# EAGLE design solderingtest (EAGLE 9.5.1)
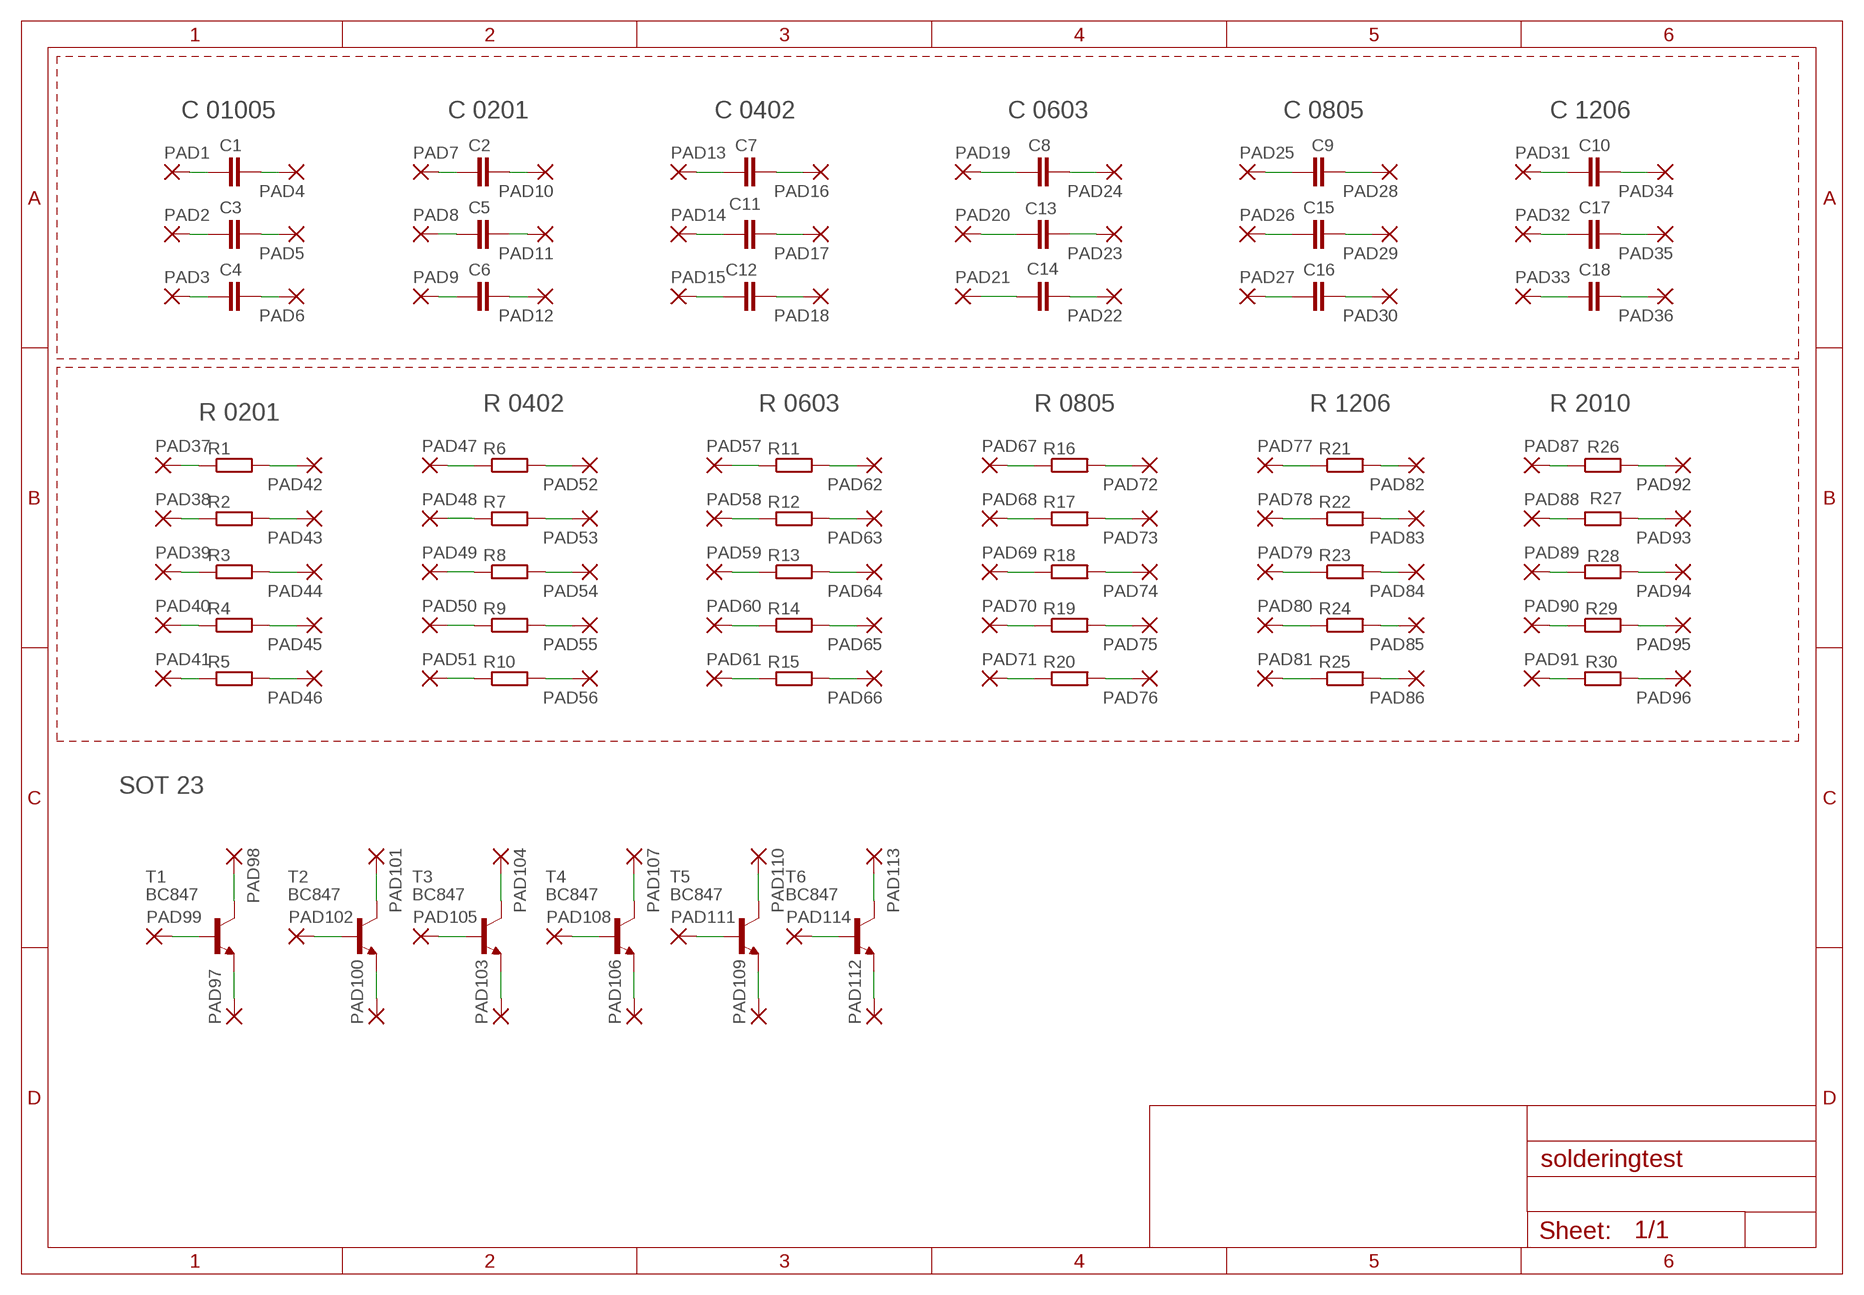
[diagram p0: schematic, sheet 1]

## Parts
C1  C-EU01005  [C01005]
C2  C-EUC0201  [C0201]
C3  C-EU01005  [C01005]
C4  C-EU01005  [C01005]
C5  C-EUC0201  [C0201]
C6  C-EUC0201  [C0201]
C7  C-EUC0402  [C0402]
C8  C-EUC0603  [C0603]
C9  C-EUC0805  [C0805]
C10  C-EUC1206  [C1206]
C11  C-EUC0402  [C0402]
C12  C-EUC0402  [C0402]
C13  C-EUC0603  [C0603]
C14  C-EUC0603  [C0603]
C15  C-EUC0805  [C0805]
C16  C-EUC0805  [C0805]
C17  C-EUC1206  [C1206]
C18  C-EUC1206  [C1206]
PAD1  2,54/1,0  [2,54/1,0]
PAD2  2,54/1,0  [2,54/1,0]
PAD3  2,54/1,0  [2,54/1,0]
PAD4  2,54/1,0  [2,54/1,0]
PAD5  2,54/1,0  [2,54/1,0]
PAD6  2,54/1,0  [2,54/1,0]
PAD7  2,54/1,0  [2,54/1,0]
PAD8  2,54/1,0  [2,54/1,0]
PAD9  2,54/1,0  [2,54/1,0]
PAD10  2,54/1,0  [2,54/1,0]
PAD11  2,54/1,0  [2,54/1,0]
PAD12  2,54/1,0  [2,54/1,0]
PAD13  2,54/1,0  [2,54/1,0]
PAD14  2,54/1,0  [2,54/1,0]
PAD15  2,54/1,0  [2,54/1,0]
PAD16  2,54/1,0  [2,54/1,0]
PAD17  2,54/1,0  [2,54/1,0]
PAD18  2,54/1,0  [2,54/1,0]
PAD19  2,54/1,0  [2,54/1,0]
PAD20  2,54/1,0  [2,54/1,0]
PAD21  2,54/1,0  [2,54/1,0]
PAD22  2,54/1,0  [2,54/1,0]
PAD23  2,54/1,0  [2,54/1,0]
PAD24  2,54/1,0  [2,54/1,0]
PAD25  2,54/1,0  [2,54/1,0]
PAD26  2,54/1,0  [2,54/1,0]
PAD27  2,54/1,0  [2,54/1,0]
PAD28  2,54/1,0  [2,54/1,0]
PAD29  2,54/1,0  [2,54/1,0]
PAD30  2,54/1,0  [2,54/1,0]
PAD31  2,54/1,0  [2,54/1,0]
PAD32  2,54/1,0  [2,54/1,0]
PAD33  2,54/1,0  [2,54/1,0]
PAD34  2,54/1,0  [2,54/1,0]
PAD35  2,54/1,0  [2,54/1,0]
PAD36  2,54/1,0  [2,54/1,0]
PAD37  2,54/1,0  [2,54/1,0]
PAD38  2,54/1,0  [2,54/1,0]
PAD39  2,54/1,0  [2,54/1,0]
PAD40  2,54/1,0  [2,54/1,0]
PAD41  2,54/1,0  [2,54/1,0]
PAD42  2,54/1,0  [2,54/1,0]
PAD43  2,54/1,0  [2,54/1,0]
PAD44  2,54/1,0  [2,54/1,0]
PAD45  2,54/1,0  [2,54/1,0]
PAD46  2,54/1,0  [2,54/1,0]
PAD47  2,54/1,0  [2,54/1,0]
PAD48  2,54/1,0  [2,54/1,0]
PAD49  2,54/1,0  [2,54/1,0]
PAD50  2,54/1,0  [2,54/1,0]
PAD51  2,54/1,0  [2,54/1,0]
PAD52  2,54/1,0  [2,54/1,0]
PAD53  2,54/1,0  [2,54/1,0]
PAD54  2,54/1,0  [2,54/1,0]
PAD55  2,54/1,0  [2,54/1,0]
PAD56  2,54/1,0  [2,54/1,0]
PAD57  2,54/1,0  [2,54/1,0]
PAD58  2,54/1,0  [2,54/1,0]
PAD59  2,54/1,0  [2,54/1,0]
PAD60  2,54/1,0  [2,54/1,0]
PAD61  2,54/1,0  [2,54/1,0]
PAD62  2,54/1,0  [2,54/1,0]
PAD63  2,54/1,0  [2,54/1,0]
PAD64  2,54/1,0  [2,54/1,0]
PAD65  2,54/1,0  [2,54/1,0]
PAD66  2,54/1,0  [2,54/1,0]
PAD67  2,54/1,0  [2,54/1,0]
PAD68  2,54/1,0  [2,54/1,0]
PAD69  2,54/1,0  [2,54/1,0]
PAD70  2,54/1,0  [2,54/1,0]
PAD71  2,54/1,0  [2,54/1,0]
PAD72  2,54/1,0  [2,54/1,0]
PAD73  2,54/1,0  [2,54/1,0]
PAD74  2,54/1,0  [2,54/1,0]
PAD75  2,54/1,0  [2,54/1,0]
PAD76  2,54/1,0  [2,54/1,0]
PAD77  2,54/1,0  [2,54/1,0]
PAD78  2,54/1,0  [2,54/1,0]
PAD79  2,54/1,0  [2,54/1,0]
PAD80  2,54/1,0  [2,54/1,0]
PAD81  2,54/1,0  [2,54/1,0]
PAD82  2,54/1,0  [2,54/1,0]
PAD83  2,54/1,0  [2,54/1,0]
PAD84  2,54/1,0  [2,54/1,0]
PAD85  2,54/1,0  [2,54/1,0]
PAD86  2,54/1,0  [2,54/1,0]
PAD87  2,54/1,0  [2,54/1,0]
PAD88  2,54/1,0  [2,54/1,0]
PAD89  2,54/1,0  [2,54/1,0]
PAD90  2,54/1,0  [2,54/1,0]
PAD91  2,54/1,0  [2,54/1,0]
PAD92  2,54/1,0  [2,54/1,0]
PAD93  2,54/1,0  [2,54/1,0]
PAD94  2,54/1,0  [2,54/1,0]
PAD95  2,54/1,0  [2,54/1,0]
PAD96  2,54/1,0  [2,54/1,0]
PAD97  2,54/1,0  [2,54/1,0]
PAD98  2,54/1,0  [2,54/1,0]
PAD99  2,54/1,0  [2,54/1,0]
PAD100  2,54/1,0  [2,54/1,0]
PAD101  2,54/1,0  [2,54/1,0]
PAD102  2,54/1,0  [2,54/1,0]
PAD103  2,54/1,0  [2,54/1,0]
PAD104  2,54/1,0  [2,54/1,0]
PAD105  2,54/1,0  [2,54/1,0]
PAD106  2,54/1,0  [2,54/1,0]
PAD107  2,54/1,0  [2,54/1,0]
PAD108  2,54/1,0  [2,54/1,0]
PAD109  2,54/1,0  [2,54/1,0]
PAD110  2,54/1,0  [2,54/1,0]
PAD111  2,54/1,0  [2,54/1,0]
PAD112  2,54/1,0  [2,54/1,0]
PAD113  2,54/1,0  [2,54/1,0]
PAD114  2,54/1,0  [2,54/1,0]
R1  R-EU_R0201  [R0201]
R2  R-EU_R0201  [R0201]
R3  R-EU_R0201  [R0201]
R4  R-EU_R0201  [R0201]
R5  R-EU_R0201  [R0201]
R6  R-EU_R0402  [R0402]
R7  R-EU_R0402  [R0402]
R8  R-EU_R0402  [R0402]
R9  R-EU_R0402  [R0402]
R10  R-EU_R0402  [R0402]
R11  R-EU_R0603  [R0603]
R12  R-EU_R0603  [R0603]
R13  R-EU_R0603  [R0603]
R14  R-EU_R0603  [R0603]
R15  R-EU_R0603  [R0603]
R16  R-EU_R0805  [R0805]
R17  R-EU_R0805  [R0805]
R18  R-EU_R0805  [R0805]
R19  R-EU_R0805  [R0805]
R20  R-EU_R0805  [R0805]
R21  R-EU_R1206  [R1206]
R22  R-EU_R1206  [R1206]
R23  R-EU_R1206  [R1206]
R24  R-EU_R1206  [R1206]
R25  R-EU_R1206  [R1206]
R26  R-EU_R2010  [R2010]
R27  R-EU_R2010  [R2010]
R28  R-EU_R2010  [R2010]
R29  R-EU_R2010  [R2010]
R30  R-EU_R2010  [R2010]
T1  BC847  [SOT23]
T2  BC847  [SOT23]
T3  BC847  [SOT23]
T4  BC847  [SOT23]
T5  BC847  [SOT23]
T6  BC847  [SOT23]

## Nets
N$1: C1.1 PAD1.1(P)
N$2: C3.1 PAD2.1(P)
N$3: C4.1 PAD3.1(P)
N$4: C4.2 PAD6.1(P)
N$5: C3.2 PAD5.1(P)
N$6: C1.2 PAD4.1(P)
N$7: C2.1 PAD7.1(P)
N$8: C2.2 PAD10.1(P)
N$9: C5.2 PAD11.1(P)
N$10: C5.1 PAD8.1(P)
N$11: C6.1 PAD9.1(P)
N$12: C6.2 PAD12.1(P)
N$13: C7.1 PAD13.1(P)
N$14: C7.2 PAD16.1(P)
N$15: C11.2 PAD17.1(P)
N$16: C11.1 PAD14.1(P)
N$17: C12.1 PAD15.1(P)
N$18: C12.2 PAD18.1(P)
N$19: C8.1 PAD19.1(P)
N$20: C8.2 PAD24.1(P)
N$21: C13.2 PAD23.1(P)
N$22: C14.2 PAD22.1(P)
N$23: C14.1 PAD21.1(P)
N$24: C13.1 PAD20.1(P)
N$25: C9.1 PAD25.1(P)
N$26: C15.1 PAD26.1(P)
N$27: C16.1 PAD27.1(P)
N$28: C9.2 PAD28.1(P)
N$29: C15.2 PAD29.1(P)
N$30: C16.2 PAD30.1(P)
N$31: C10.1 PAD31.1(P)
N$32: C17.1 PAD32.1(P)
N$33: C18.1 PAD33.1(P)
N$34: C10.2 PAD34.1(P)
N$35: C17.2 PAD35.1(P)
N$36: C18.2 PAD36.1(P)
N$37: PAD37.1(P) R1.1
N$38: PAD42.1(P) R1.2
N$39: PAD43.1(P) R2.2
N$40: PAD44.1(P) R3.2
N$41: PAD45.1(P) R4.2
N$42: PAD40.1(P) R4.1
N$43: PAD39.1(P) R3.1
N$44: PAD38.1(P) R2.1
N$45: PAD41.1(P) R5.1
N$46: PAD46.1(P) R5.2
N$47: PAD47.1(P) R6.1
N$48: PAD52.1(P) R6.2
N$49: PAD53.1(P) R7.2
N$50: PAD54.1(P) R8.2
N$51: PAD55.1(P) R9.2
N$52: PAD56.1(P) R10.2
N$53: PAD51.1(P) R10.1
N$54: PAD50.1(P) R9.1
N$55: PAD49.1(P) R8.1
N$56: PAD48.1(P) R7.1
N$57: PAD58.1(P) R12.1
N$58: PAD59.1(P) R13.1
N$59: PAD60.1(P) R14.1
N$60: PAD61.1(P) R15.1
N$61: PAD66.1(P) R15.2
N$62: PAD65.1(P) R14.2
N$63: PAD64.1(P) R13.2
N$64: PAD63.1(P) R12.2
N$65: PAD57.1(P) R11.1
N$66: PAD62.1(P) R11.2
N$67: PAD67.1(P) R16.1
N$68: PAD68.1(P) R17.1
N$69: PAD69.1(P) R18.1
N$70: PAD70.1(P) R19.1
N$71: PAD71.1(P) R20.1
N$72: PAD76.1(P) R20.2
N$73: PAD75.1(P) R19.2
N$74: PAD74.1(P) R18.2
N$75: PAD73.1(P) R17.2
N$76: PAD72.1(P) R16.2
N$77: PAD77.1(P) R21.1
N$78: PAD78.1(P) R22.1
N$79: PAD79.1(P) R23.1
N$80: PAD80.1(P) R24.1
N$81: PAD81.1(P) R25.1
N$82: PAD82.1(P) R21.2
N$83: PAD83.1(P) R22.2
N$84: PAD84.1(P) R23.2
N$85: PAD85.1(P) R24.2
N$86: PAD86.1(P) R25.2
N$87: PAD87.1(P) R26.1
N$88: PAD88.1(P) R27.1
N$89: PAD89.1(P) R28.1
N$90: PAD90.1(P) R29.1
N$91: PAD91.1(P) R30.1
N$92: PAD92.1(P) R26.2
N$93: PAD93.1(P) R27.2
N$94: PAD94.1(P) R28.2
N$95: PAD95.1(P) R29.2
N$96: PAD96.1(P) R30.2
N$97: PAD99.1(P) T1.1(B)
N$98: PAD98.1(P) T1.3(C)
N$99: PAD97.1(P) T1.2(E)
N$100: PAD102.1(P) T2.1(B)
N$101: PAD101.1(P) T2.3(C)
N$102: PAD100.1(P) T2.2(E)
N$103: PAD105.1(P) T3.1(B)
N$104: PAD104.1(P) T3.3(C)
N$105: PAD103.1(P) T3.2(E)
N$106: PAD108.1(P) T4.1(B)
N$107: PAD107.1(P) T4.3(C)
N$108: PAD106.1(P) T4.2(E)
N$109: PAD111.1(P) T5.1(B)
N$110: PAD110.1(P) T5.3(C)
N$111: PAD109.1(P) T5.2(E)
N$112: PAD114.1(P) T6.1(B)
N$113: PAD113.1(P) T6.3(C)
N$114: PAD112.1(P) T6.2(E)

## Notes on the sheet
- C 01005 | C 0201 | C 0402 | C 0603 | C 0805 | C 1206
- R 0402 | R 0603 | R 0805 | R 1206 | R 2010
- R 0201
- SOT 23

## Library data of the parts
C1-C18 = rcl:C-EU: CAPACITOR, European symbol; SPICEPREFIX: C
PAD1-PAD114 = wirepad:2,54/1,0: THROUGH-HOLE PAD
R1-R30 = rcl:R-EU_: RESISTOR, European symbol; SPICEPREFIX: R
T1-T6 = transistor:BC847: NPN TRANSISTOR

## Board
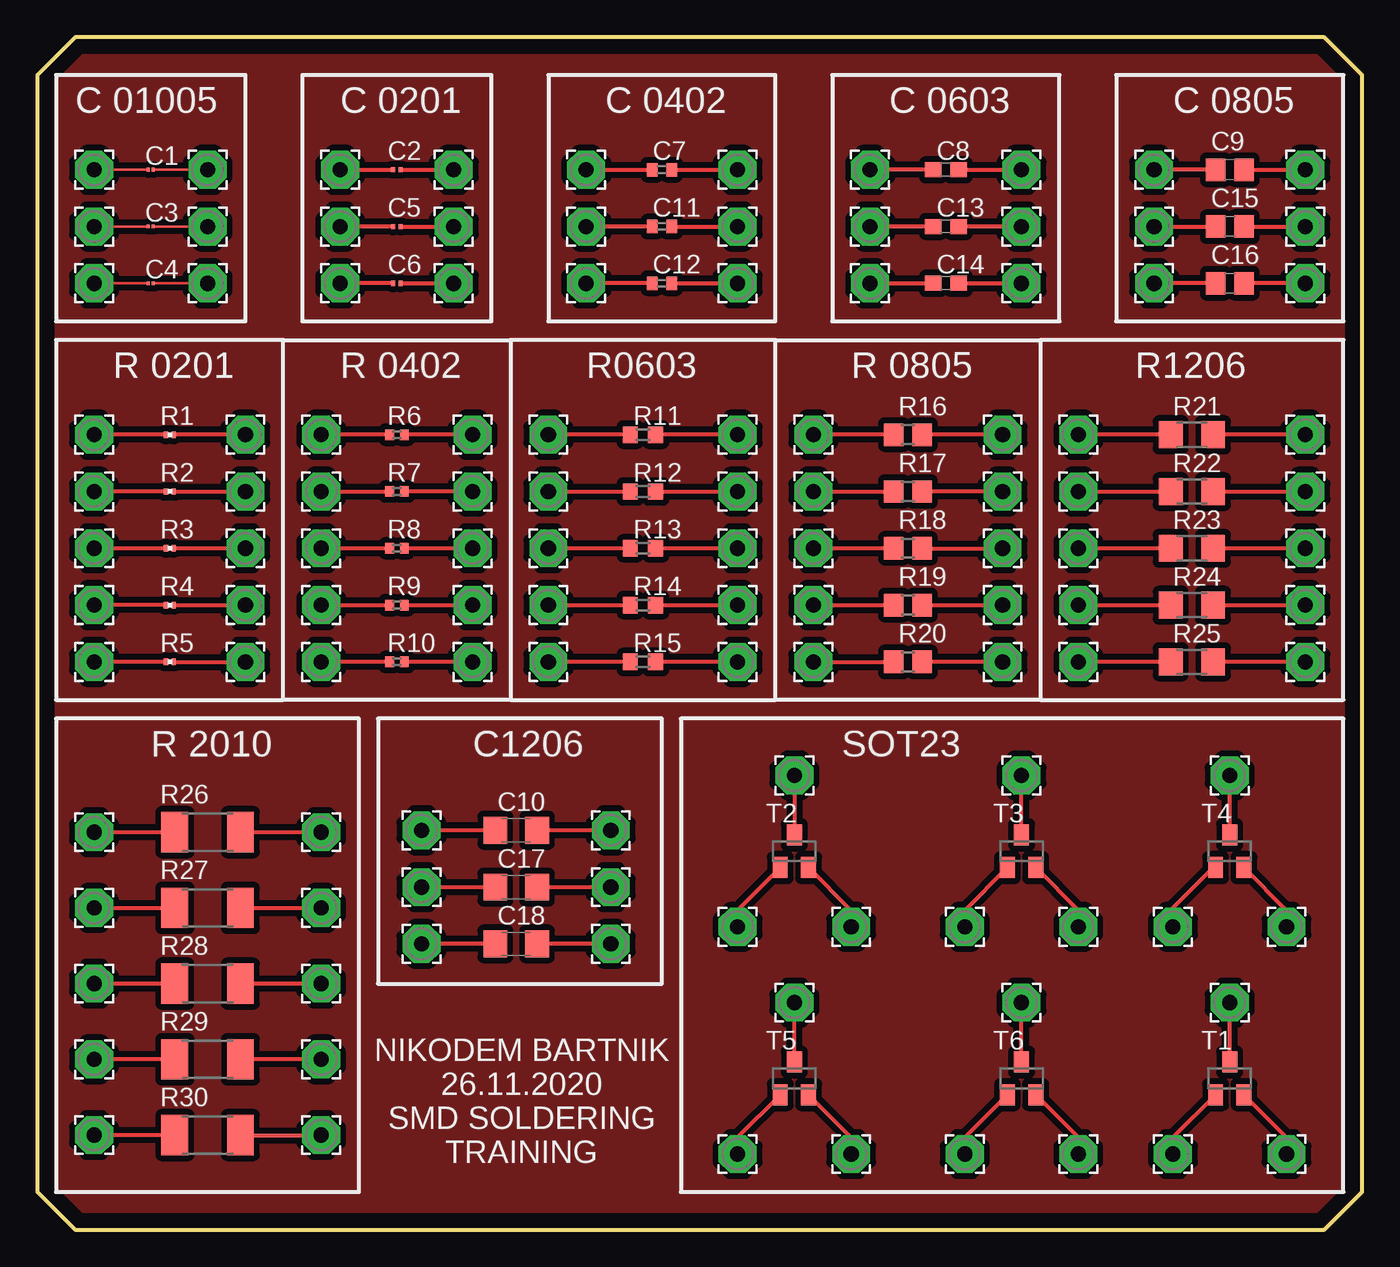
[diagram p1: board, top side]
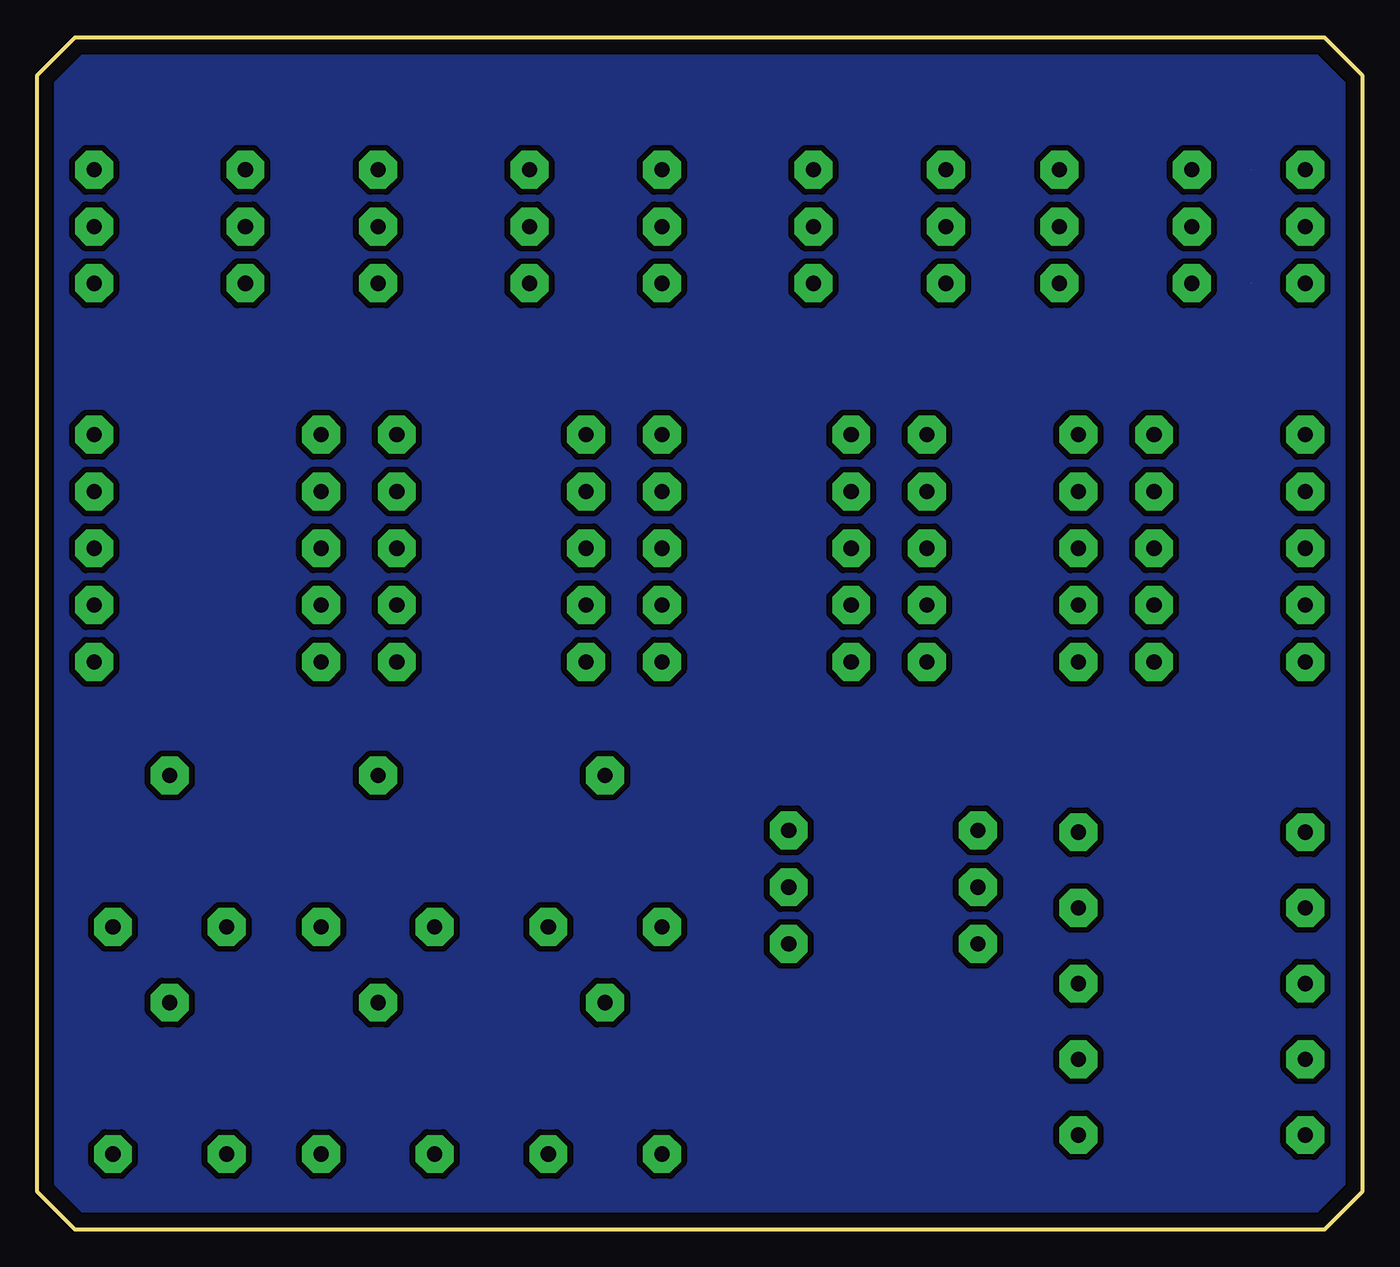
[diagram p2: board, bottom side, seen from below]

Size 88.9 x 80.01 mm. Coordinates in mm from the lower left corner, seen from the top.
Outline: 2.54,0 86.36,0 88.9,2.54 88.9,77.47 86.36,80.01 2.54,80.01 0,77.47 0,2.54 2.54,0
Copper layers (1*16): Top 0.035mm / dielectric 1.5mm / Bottom 0.035mm
Design rules "default": minimum track width 6mil, minimum drill 0.35mm, track to track 6mil, track to pad 6mil, pad to pad 6mil, via to via 6mil, smd to smd 6mil, copper to edge 40mil, drill to drill 6mil, minimum pad ring 10mil, minimum via ring 8mil, stop-mask expansion 4mil, vias tented up to drill 0mil, thermal gap 10mil

### Footprints (pad centres in the part's own frame; a part is rotated, then mirrored left to right if it is on the bottom)
C01005 = smd 0.2 x 0.25: 1 -0.163,0; 2 0.163,0
C0201 = smd 0.25 x 0.35: 1 -0.25,0; 2 0.25,0
C0402 = smd 0.7 x 0.9: 1 -0.65,0; 2 0.65,0
C0603 = smd 1.1 x 1: 1 -0.85,0; 2 0.85,0
C0805 = smd 1.3 x 1.5: 1 -0.95,0; 2 0.95,0
C1206 = smd 1.6 x 1.8: 1 -1.4,0; 2 1.4,0
2,54/1,0 = drill 1.016 pad 2.54 octagon: 1 0,0
R0201 = smd 0.28 x 0.43: 1 -0.255,0; 2 0.255,0
R0402 = smd 0.6 x 0.7: 1 -0.5,0; 2 0.5,0
R0603 = smd 1 x 1.1: 1 -0.85,0; 2 0.85,0
R0805 = smd 1.3 x 1.5: 1 -0.95,0; 2 0.95,0
R1206 = smd 1.6 x 1.803: 1 -1.422,0; 2 1.422,0
R2010 = smd 1.8 x 2.7: 1 -2.2,0; 2 2.2,0
SOT23 = smd 1 x 1.4: 1 -0.95,-1.1; 2 0.95,-1.1; 3 0,1.1

### Placement (x,y rotation side)
C1  7.62,71.12 0 top
C2  24.13,71.12 0 top
C3  7.62,67.31 0 top
C4  7.62,63.5 0 top
C5  24.13,67.31 0 top
C6  24.13,63.5 0 top
C7  41.91,71.12 0 top
C8  60.96,71.12 0 top
C9  80.01,71.12 0 top
C10  32.13,26.8 0 top
C11  41.91,67.31 0 top
C12  41.91,63.5 0 top
C13  60.96,67.31 0 top
C14  60.96,63.5 0 top
C15  80.01,67.31 0 top
C16  80.01,63.5 0 top
C17  32.13,22.99 0 top
C18  32.13,19.18 0 top
PAD1  3.81,71.12 0 top
PAD2  3.81,67.31 0 top
PAD3  3.81,63.5 0 top
PAD4  11.43,71.12 0 top
PAD5  11.43,67.31 0 top
PAD6  11.43,63.5 0 top
PAD7  20.32,71.12 0 top
PAD8  20.32,67.31 0 top
PAD9  20.32,63.5 0 top
PAD10  27.94,71.12 0 top
PAD11  27.94,67.31 0 top
PAD12  27.94,63.5 0 top
PAD13  36.83,71.12 0 top
PAD14  36.83,67.31 0 top
PAD15  36.83,63.5 0 top
PAD16  46.99,71.12 0 top
PAD17  46.99,67.31 0 top
PAD18  46.99,63.5 0 top
PAD19  55.88,71.12 0 top
PAD20  55.88,67.31 0 top
PAD21  55.88,63.5 0 top
PAD22  66.04,63.5 0 top
PAD23  66.04,67.31 0 top
PAD24  66.04,71.12 0 top
PAD25  74.93,71.12 0 top
PAD26  74.93,67.31 0 top
PAD27  74.93,63.5 0 top
PAD28  85.09,71.12 0 top
PAD29  85.09,67.31 0 top
PAD30  85.09,63.5 0 top
PAD31  25.78,26.8 0 top
PAD32  25.78,22.99 0 top
PAD33  25.78,19.18 0 top
PAD34  38.48,26.8 0 top
PAD35  38.48,22.99 0 top
PAD36  38.48,19.18 0 top
PAD37  3.81,53.34 0 top
PAD38  3.81,49.53 0 top
PAD39  3.81,45.72 0 top
PAD40  3.81,41.91 0 top
PAD41  3.81,38.1 0 top
PAD42  13.97,53.34 0 top
PAD43  13.97,49.53 0 top
PAD44  13.97,45.72 0 top
PAD45  13.97,41.91 0 top
PAD46  13.97,38.1 0 top
PAD47  19.05,53.34 0 top
PAD48  19.05,49.53 0 top
PAD49  19.05,45.72 0 top
PAD50  19.05,41.91 0 top
PAD51  19.05,38.1 0 top
PAD52  29.21,53.34 0 top
PAD53  29.21,49.53 0 top
PAD54  29.21,45.72 0 top
PAD55  29.21,41.91 0 top
PAD56  29.21,38.1 0 top
PAD57  34.29,53.34 0 top
PAD58  34.29,49.53 0 top
PAD59  34.29,45.72 0 top
PAD60  34.29,41.91 0 top
PAD61  34.29,38.1 0 top
PAD62  46.99,53.34 0 top
PAD63  46.99,49.53 0 top
PAD64  46.99,45.72 0 top
PAD65  46.99,41.91 0 top
PAD66  46.99,38.1 0 top
PAD67  52.07,53.34 0 top
PAD68  52.07,49.53 0 top
PAD69  52.07,45.72 0 top
PAD70  52.07,41.91 0 top
PAD71  52.07,38.1 0 top
PAD72  64.77,53.34 0 top
PAD73  64.77,49.53 0 top
PAD74  64.77,45.72 0 top
PAD75  64.77,41.91 0 top
PAD76  64.77,38.1 0 top
PAD77  69.85,53.34 0 top
PAD78  69.85,49.53 0 top
PAD79  69.85,45.72 0 top
PAD80  69.85,41.91 0 top
PAD81  69.85,38.1 0 top
PAD82  85.09,53.34 0 top
PAD83  85.09,49.53 0 top
PAD84  85.09,45.72 0 top
PAD85  85.09,41.91 0 top
PAD86  85.09,38.1 0 top
PAD87  3.81,26.67 0 top
PAD88  3.81,21.59 0 top
PAD89  3.81,16.51 0 top
PAD90  3.81,11.43 0 top
PAD91  3.81,6.35 0 top
PAD92  19.05,26.67 0 top
PAD93  19.05,21.59 0 top
PAD94  19.05,16.51 0 top
PAD95  19.05,11.43 0 top
PAD96  19.05,6.35 0 top
PAD97  83.82,5.08 0 top
PAD98  80.01,15.24 0 top
PAD99  76.2,5.08 0 top
PAD100  54.61,20.32 0 top
PAD101  50.8,30.48 0 top
PAD102  46.99,20.32 0 top
PAD103  69.85,20.32 0 top
PAD104  66.04,30.48 0 top
PAD105  62.23,20.32 0 top
PAD106  83.82,20.32 0 top
PAD107  80.01,30.48 0 top
PAD108  76.2,20.32 0 top
PAD109  54.61,5.08 0 top
PAD110  50.8,15.24 0 top
PAD111  46.99,5.08 0 top
PAD112  69.85,5.08 0 top
PAD113  66.04,15.24 0 top
PAD114  62.23,5.08 0 top
R1  8.89,53.34 0 top
R2  8.89,49.53 0 top
R3  8.89,45.72 0 top
R4  8.89,41.91 0 top
R5  8.89,38.1 0 top
R6  24.13,53.34 0 top
R7  24.13,49.53 0 top
R8  24.13,45.72 0 top
R9  24.13,41.91 0 top
R10  24.13,38.1 0 top
R11  40.64,53.34 0 top
R12  40.64,49.53 0 top
R13  40.64,45.72 0 top
R14  40.64,41.91 0 top
R15  40.64,38.1 0 top
R16  58.42,53.34 0 top
R17  58.42,49.53 0 top
R18  58.42,45.72 0 top
R19  58.42,41.91 0 top
R20  58.42,38.1 0 top
R21  77.47,53.34 0 top
R22  77.47,49.53 0 top
R23  77.47,45.72 0 top
R24  77.47,41.91 0 top
R25  77.47,38.1 0 top
R26  11.43,26.67 0 top
R27  11.43,21.59 0 top
R28  11.43,16.51 0 top
R29  11.43,11.43 0 top
R30  11.43,6.35 0 top
T1  80.01,10.16 0 top
T2  50.8,25.4 0 top
T3  66.04,25.4 0 top
T4  80.01,25.4 0 top
T5  50.8,10.16 0 top
T6  66.04,10.16 0 top

### Tracks (layer width: path | path; a pad name or v marks a point on that pad's centre or on a via)
GND
  pour Top (isolate 0.406): 0,77.47 0,2.54 2.54,0 86.36,0 88.9,2.54 88.9,77.47 86.36,80.01 2.54,80.01
  pour Bottom (isolate 0.406): 0,2.54 2.54,0 86.36,0 88.9,2.54 88.9,77.47 86.36,80.01 2.54,80.01 0,77.47
N$1  (1 unrouted)
  Top 0.152: PAD1.1 C1.1
N$2
  Top 0.152: C3.1 PAD2.1
N$3  (1 unrouted)
  Top 0.152: PAD3.1 C4.1
N$4
  Top 0.152: C4.2 PAD6.1
N$5
  Top 0.152: C3.2 PAD5.1
N$6
  Top 0.152: C1.2 PAD4.1
N$7
  Top 0.254: PAD7.1 C2.1
N$8
  Top 0.254: C2.2 PAD10.1
N$9
  Top 0.254: C5.2 PAD11.1
N$10
  Top 0.254: C5.1 PAD8.1
N$11
  Top 0.254: C6.1 PAD9.1
N$12
  Top 0.254: C6.2 PAD12.1
N$13
  Top 0.254: PAD13.1 C7.1
N$14
  Top 0.254: C7.2 PAD16.1
N$15
  Top 0.254: C11.2 PAD17.1
N$16
  Top 0.254: C11.1 PAD14.1
N$17
  Top 0.254: C12.1 PAD15.1
N$18
  Top 0.254: C12.2 PAD18.1
N$19
  Top 0.254: C8.1 PAD19.1
N$20
  Top 0.254: C8.2 PAD24.1
N$21
  Top 0.254: PAD23.1 C13.2
N$22
  Top 0.254: C14.2 PAD22.1
N$23
  Top 0.254: PAD21.1 C14.1
N$24
  Top 0.254: C13.1 PAD20.1
N$25
  Top 0.254: C9.1 PAD25.1
N$26
  Top 0.254: PAD26.1 C15.1
N$27
  Top 0.254: C16.1 PAD27.1
N$28
  Top 0.254: C9.2 PAD28.1
N$29
  Top 0.254: C15.2 PAD29.1
N$30
  Top 0.254: PAD30.1 C16.2
N$31
  Top 0.254: C10.1 PAD31.1
N$32
  Top 0.254: PAD32.1 C17.1
N$33
  Top 0.254: C18.1 PAD33.1
N$34
  Top 0.254: PAD34.1 C10.2
N$35
  Top 0.254: C17.2 PAD35.1
N$36
  Top 0.254: PAD36.1 C18.2
N$37
  Top 0.254: R1.1 PAD37.1
N$38
  Top 0.254: PAD42.1 R1.2
N$39
  Top 0.254: R2.2 PAD43.1
N$40
  Top 0.254: PAD44.1 R3.2
N$41
  Top 0.254: R4.2 PAD45.1
N$42
  Top 0.254: R4.1 PAD40.1
N$43
  Top 0.254: R3.1 PAD39.1
N$44
  Top 0.254: R2.1 PAD38.1
N$45
  Top 0.254: R5.1 PAD41.1
N$46
  Top 0.254: R5.2 PAD46.1
N$47
  Top 0.254: R6.1 PAD47.1
N$48
  Top 0.254: PAD52.1 R6.2
N$49
  Top 0.254: PAD53.1 R7.2
N$50
  Top 0.254: PAD54.1 R8.2
N$51
  Top 0.254: R9.2 PAD55.1
N$52
  Top 0.254: PAD56.1 R10.2
N$53
  Top 0.254: R10.1 PAD51.1
N$54
  Top 0.254: PAD50.1 R9.1
N$55
  Top 0.254: R8.1 PAD49.1
N$56
  Top 0.254: PAD48.1 R7.1
N$57
  Top 0.254: PAD58.1 R12.1
N$58
  Top 0.254: R13.1 PAD59.1
N$59
  Top 0.254: PAD60.1 R14.1
N$60
  Top 0.254: R15.1 PAD61.1
N$61
  Top 0.254: PAD66.1 R15.2
N$62
  Top 0.254: R14.2 PAD65.1
N$63
  Top 0.254: PAD64.1 R13.2
N$64
  Top 0.254: R12.2 PAD63.1
N$65
  Top 0.254: R11.1 PAD57.1
N$66
  Top 0.254: PAD62.1 R11.2
N$67
  Top 0.254: R16.1 PAD67.1
N$68
  Top 0.254: PAD68.1 R17.1
N$69
  Top 0.254: R18.1 PAD69.1
N$70
  Top 0.254: PAD70.1 R19.1
N$71
  Top 0.254: PAD71.1 R20.1
N$72
  Top 0.254: PAD76.1 R20.2
N$73
  Top 0.254: R19.2 PAD75.1
N$74
  Top 0.254: R18.2 PAD74.1
N$75
  Top 0.254: PAD73.1 R17.2
N$76
  Top 0.254: PAD72.1 R16.2
N$77
  Top 0.254: R21.1 PAD77.1
N$78
  Top 0.254: PAD78.1 R22.1
N$79
  Top 0.254: R23.1 PAD79.1
N$80
  Top 0.254: PAD80.1 R24.1
N$81
  Top 0.254: R25.1 PAD81.1
N$82
  Top 0.254: PAD82.1 R21.2
N$83
  Top 0.254: R22.2 PAD83.1
N$84
  Top 0.254: PAD84.1 R23.2
N$85
  Top 0.254: R24.2 PAD85.1
N$86
  Top 0.254: PAD86.1 R25.2
N$87
  Top 0.254: R26.1 PAD87.1
N$88
  Top 0.254: PAD88.1 R27.1
N$89
  Top 0.254: R28.1 PAD89.1
N$90
  Top 0.254: R29.1 PAD90.1
N$91
  Top 0.254: R30.1 PAD91.1
N$92
  Top 0.254: PAD92.1 R26.2
N$93
  Top 0.254: R27.2 PAD93.1
N$94
  Top 0.254: PAD94.1 R28.2
N$95
  Top 0.254: PAD95.1 R29.2
N$96
  Top 0.254: R30.2 PAD96.1
N$97
  Top 0.254: T1.1 76.2,6.2 PAD99.1
N$98
  Top 0.254: T1.3 PAD98.1
N$99
  Top 0.254: T1.2 83.82,6.2 PAD97.1
N$100
  Top 0.254: PAD102.1 46.99,21.44 T2.1
N$101
  Top 0.254: PAD101.1 T2.3
N$102
  Top 0.254: T2.2 54.61,21.44 PAD100.1
N$103
  Top 0.254: PAD105.1 62.23,21.44 T3.1
N$104
  Top 0.254: T3.3 PAD104.1
N$105
  Top 0.254: T3.2 69.85,21.44 PAD103.1
N$106
  Top 0.254: PAD108.1 76.2,21.59 78.91,24.3 T4.1
N$107
  Top 0.254: T4.3 PAD107.1
N$108
  Top 0.254: T4.2 83.82,21.44 PAD106.1
N$109
  Top 0.254: PAD111.1 46.99,6.2 T5.1
N$110
  Top 0.254: T5.3 PAD110.1
N$111
  Top 0.254: T5.2 54.61,6.2 PAD109.1
N$112
  Top 0.254: T6.1 62.23,6.2 PAD114.1
N$113
  Top 0.254: T6.3 PAD113.1
N$114
  Top 0.254: T6.2 69.85,6.2 PAD112.1

### Text on the board
tNames: C 01005 | C 0201 | C 0402 | C 0603 | C 0805 | R 0201 | R 0402 | R0603 | R 0805 | R1206 | SOT23 | R 2010 | C1206 | NIKODEM BARTNIK / 26.11.2020 / SMD SOLDERING / TRAINING